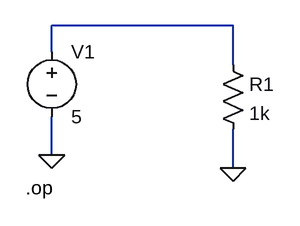
[diagram p0: schematic single_resistor.asc]
single_resistor.asc, the LTspice schematic file:
Version 4
SHEET 1 880 680
WIRE 256 112 32 112
WIRE 32 144 32 112
WIRE 256 160 256 112
WIRE 32 272 32 224
WIRE 256 288 256 240
FLAG 32 272 0
FLAG 256 288 0
SYMBOL res 240 144 R0
SYMATTR InstName R1
SYMATTR Value 1k
SYMBOL voltage 32 128 R0
WINDOW 123 0 0 Left 0
WINDOW 39 0 0 Left 0
SYMATTR InstName V1
SYMATTR Value 5
TEXT 0 312 Left 2 !.op

The netlist it stands for:
* single_resistor.asc
R1 N001 0 1k
V1 N001 0 5
.op
.backanno
.end